# EAGLE design asynclabs_yellowjacket_v1 (EAGLE 5.06)
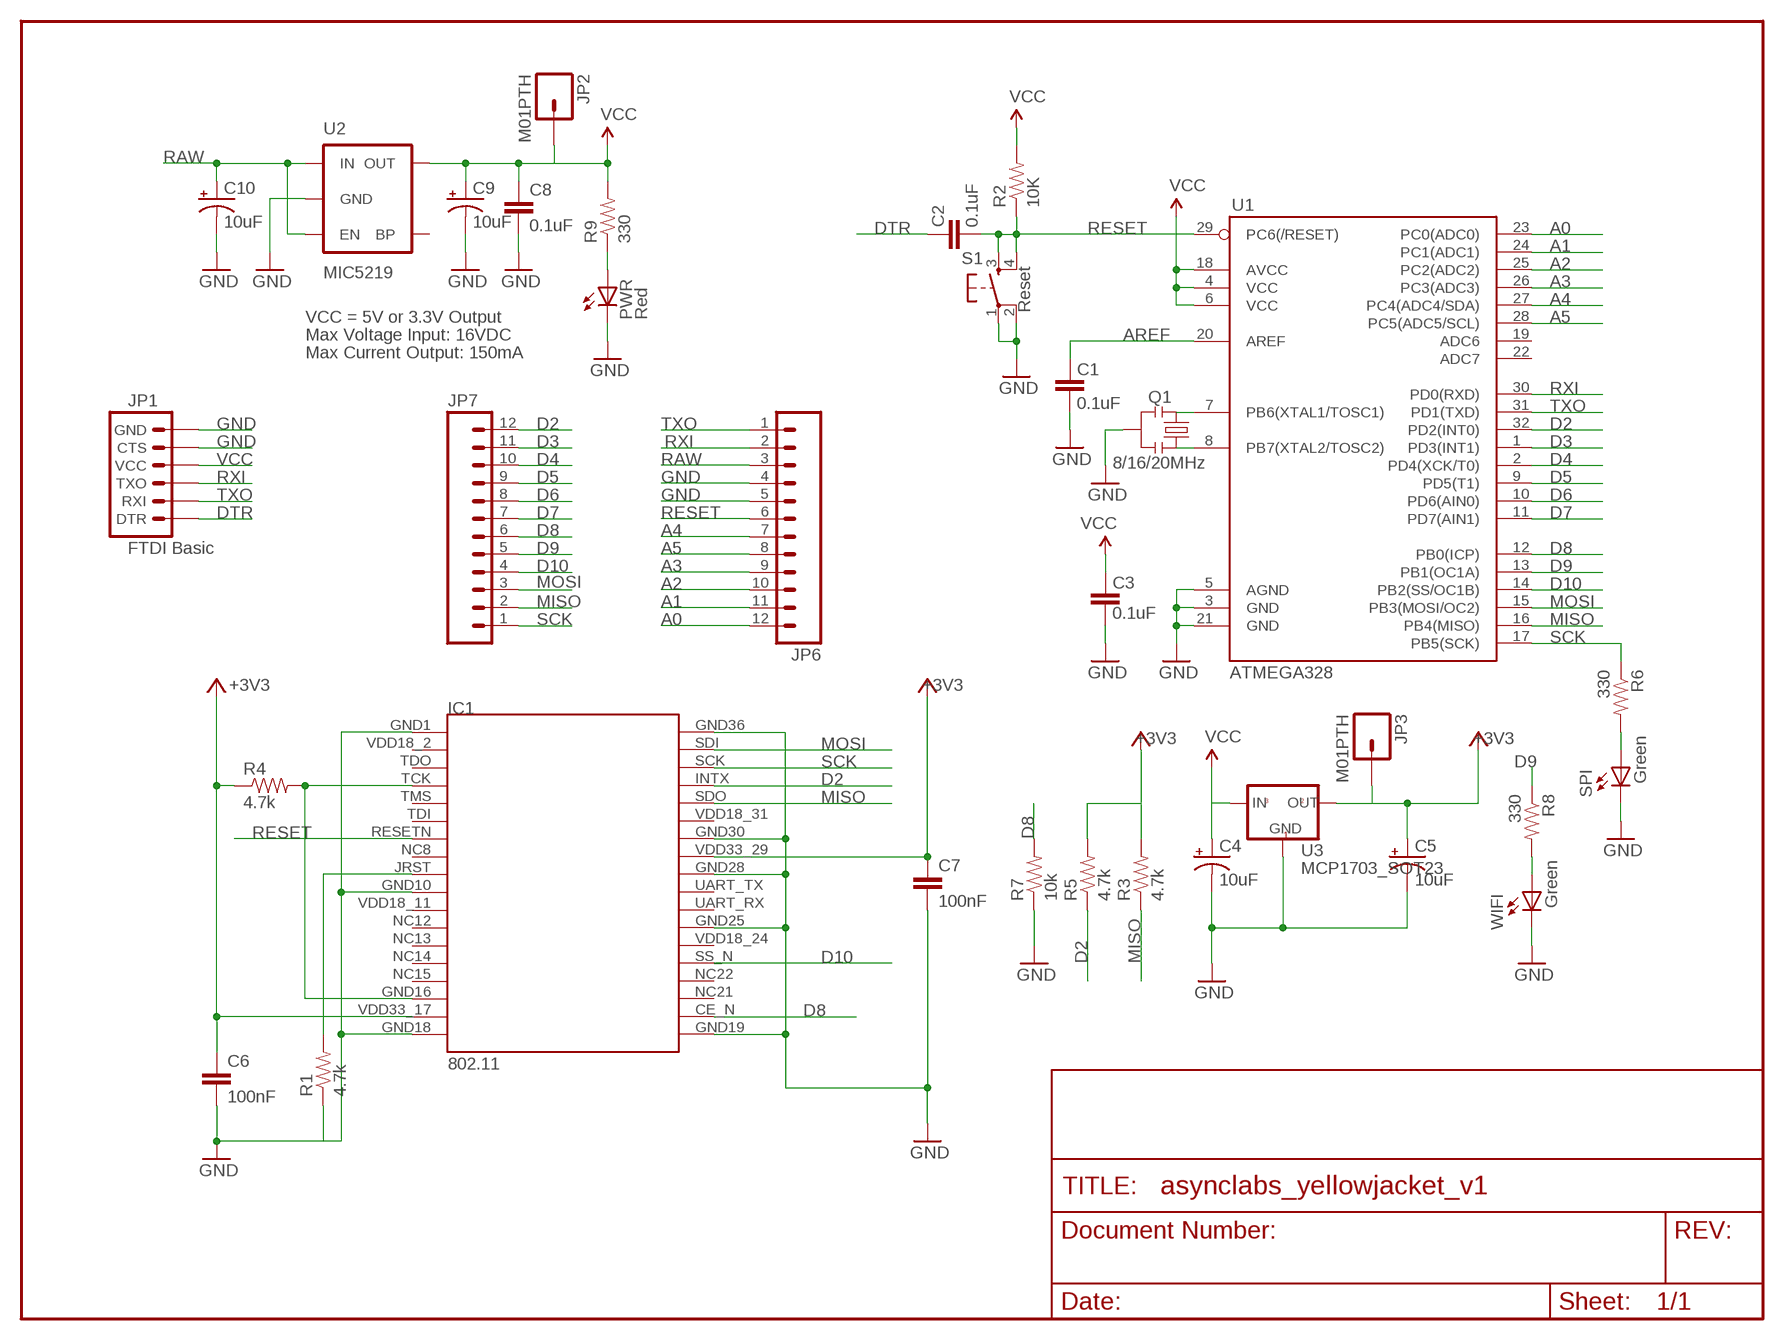
[diagram p0: schematic, sheet 1]

## Parts
C1  0.1uF  CAP0402  [C0402]
C2  0.1uF  CAP0402  [C0402]
C3  0.1uF  CAP0402  [C0402]
C4  10uF  CAP_POL1206  [EIA3216]
C5  10uF  CAP_POL1206  [EIA3216]
C6  100nF  CAPACITOR0402-CAP  [0402-CAP]
C7  100nF  CAPACITOR0402-CAP  [0402-CAP]
C8  0.1uF  CAP0402  [C0402]
C9  10uF  CAP_POL1206  [EIA3216]
C10  10uF  CAP_POL1206  [EIA3216]
IC1  802.11  ZG2100MOD  [ZG2100MOD]
JP1  FTDI Basic  ARDUINO_SERIAL_PROGRAMPTH  [1X06]
JP2  M01PTH  [1X01]
JP3  M01PTH  [1X01]
JP6  M12PTH  [1X12]
JP7  M12PTH  [1X12]
PWR  Red  LED0603  [LED-0603]
Q1  8/16/20MHz  RESONATORSMD  [RESONATOR-SMD]
R1  4.7k  RESISTOR0402-RES  [0402-RES]
R2  10K  RESISTOR0402  [C0402]
R3  4.7k  RESISTOR0402-RES  [0402-RES]
R4  4.7k  RESISTOR0402-RES  [0402-RES]
R5  4.7k  RESISTOR0402-RES  [0402-RES]
R6  330  RESISTOR0402  [C0402]
R7  10k  RESISTOR0402-RES  [0402-RES]
R8  330  RESISTOR0402  [C0402]
R9  330  RESISTOR0402  [C0402]
S1  Reset  TAC_SWITCHSND  [TACTILE_SWITCH_SMD]
SPI  Green  LED0603  [LED-0603]
U1  ATMEGA328  ATMEGA168  [TQFP32-08]
U2  MIC5219  V_REG_LDOSMD  [SOT23-5]
U3  MCP1703_SOT23  [SOT23-3]
WIFI  Green  LED0603  [LED-0603]

## Nets
+3V3: C5.A(+) C6.1 C7.1 IC1.VDD33_17 IC1.VDD33_29 JP3.1 R3.2 R4.1 R5.2 U3.2(OUT)
A0: JP6.12 U1.23(PC0(ADC0))
A1: JP6.11 U1.24(PC1(ADC1))
A2: JP6.10 U1.25(PC2(ADC2))
A3: JP6.9 U1.26(PC3(ADC3))
A4: JP6.7 U1.27(PC4(ADC4/SDA))
A5: JP6.8 U1.28(PC5(ADC5/SCL))
AREF: C1.2 U1.20(AREF)
D2: IC1.INTX JP7.12 R5.1 U1.32(PD2(INT0))
D3: JP7.11 U1.1(PD3(INT1))
D4: JP7.10 U1.2(PD4(XCK/T0))
D5: JP7.9 U1.9(PD5(T1))
D6: JP7.8 U1.10(PD6(AIN0))
D7: JP7.7 U1.11(PD7(AIN1))
D8: IC1.CE_N JP7.6 R7.2 U1.12(PB0(ICP))
D9: JP7.5 R8.1 U1.13(PB1(OC1A))
D10: IC1.SS_N JP7.4 U1.14(PB2(SS/OC1B))
DTR: C2.2 JP1.1(DTR)
GND [vcc]: C1.1 C3.1 C4.C(-) C5.C(-) C6.2 C7.2 C8.2 C9.C(-) C10.C(-) IC1.GND1 IC1.GND10 IC1.GND18 IC1.GND19 IC1.GND25 IC1.GND28 IC1.GND30 IC1.GND36 JP1.5(CTS) JP1.6(GND) JP6.4 JP6.5 PWR.C Q1.2 R1.1 R7.1 S1.1 S1.2 SPI.C U1.3(GND) U1.5(AGND) U1.21(GND) U2.2(GND) U3.1(GND) WIFI.C
JRST: IC1.JRST R1.2
MISO: IC1.SDO JP7.2 R3.1 U1.16(PB4(MISO))
MOSI: IC1.SDI JP7.3 U1.15(PB3(MOSI/OC2))
N$1: Q1.1 U1.8(PB7(XTAL2/TOSC2))
N$2: Q1.3 U1.7(PB6(XTAL1/TOSC1))
N$3: R8.2 WIFI.A
N$7: R6.2 SPI.A
N$38: PWR.A R9.1
RAW [vcc]: C10.A(+) JP6.3 U2.1(IN) U2.3(EN)
RESET: C2.1 IC1.RESETN(RSTN) JP6.6 R2.1 S1.3 S1.4 U1.29(PC6(/RESET))
RXI: JP1.3(TXO) JP6.2 U1.30(PD0(RXD))
SCK: IC1.SCK JP7.1 R6.1 U1.17(PB5(SCK))
TXO: JP1.2(RXI) JP6.1 U1.31(PD1(TXD))
VCC: C3.2 C4.A(+) C8.1 C9.A(+) JP1.4(VCC) JP2.1 R2.2 R9.2 U1.4(VCC) U1.6(VCC) U1.18(AVCC) U2.5(OUT) U3.3(IN)
VDD_TIE: IC1.GND16 IC1.TCK R4.2
Unconnected: IC1.NC8 IC1.NC12 IC1.NC13 IC1.NC14 IC1.NC15 IC1.NC21 IC1.NC22 IC1.TDI IC1.TDO IC1.TMS IC1.UART_RX IC1.UART_TX IC1.VDD18_2 IC1.VDD18_11 IC1.VDD18_24 IC1.VDD18_31 U1.19(ADC6) U1.22(ADC7) U2.4(BP)

## Notes on the sheet
- VCC = 5V or 3.3V Output
- Max Voltage Input: 16VDC
- Max Current Output: 150mA

## Library data of the parts
C1-C3 C8 = SparkFun:CAP: Capacitor Standard 0603 ceramic capacitor, and 0.1" leaded capacitor.
C4 C5 = asynlabs:CAP_POL: Capacitor Polarized These are standard SMD and PTH capacitors. Normally 10uF, 47uF, and 100uF in electrolytic and tantalum varieties. Always verify the external diameter of the through hole cap, it varies with capacity, voltage, and manufacturer. The EIA devices should be standard.
C6 C7 = asynlabs:CAPACITOR: Capacitor Standard 0603 ceramic capacitor, and 0.1" leaded capacitor.
C9 C10 = SparkFun:CAP_POL: Capacitor Polarized These are standard SMD and PTH capacitors. Normally 10uF, 47uF, and 100uF in electrolytic and tantalum varieties. Always verify the external diameter of the through hole cap, it varies with capacity, voltage, and manufacturer. The EIA devices should be standard.
IC1 = ZGLIB:ZG2100MOD: ZG2100 Module
JP1 = SparkFun:ARDUINO_SERIAL_PROGRAM
JP2 JP3 = SparkFun:M01: Header 1 Standard 1-pin 0.1" header. Use with straight break away headers (SKU : PRT-00116), right angle break away headers (PRT-00553), swiss pins (PRT-00743), machine pins (PRT-00117), and female headers (PRT-00115).
JP6 JP7 = SparkFun:M12: Header 12 Standard 12-pin 0.1" header. Use with straight break away headers (SKU : PRT-00116), right angle break away headers (PRT-00553), swiss pins (PRT-00743), machine pins (PRT-00117), and female headers (PRT-00115).
PWR SPI WIFI = SparkFun:LED: LEDs Standard schematic elements and footprints for 5mm, 3mm, 1206, and 0603 sized LEDs. 5mm - Spark Fun Electronics SKU : COM-00529 (and others)
Q1 = SparkFun:RESONATOR: Resonator Small SMD resonator. This is the itty bitty 10/20MHz resonators with built in caps. CSTCE10M0G55 and CSTCE20M0V53. Footprint has been reviewed closely but hasn't been tested yet.
R1 R3-R5 R7 = asynlabs:RESISTOR: Resistor Basic schematic elements and footprints for 0603, 1206, and PTH 1/10th watt (small) resistors.
R2 R6 R8 R9 = SparkFun:RESISTOR: Resistor Basic schematic elements and footprints for 0603, 1206, and PTH 1/10th watt (small) resistors.
S1 = SparkFun:TAC_SWITCH: Momentary Switch Button commonly used for reset or general input. Spark Fun Electronics SKU : COM-00097
U1 = SparkFun:ATMEGA168
U2 = SparkFun:V_REG_LDO: Voltage Regulator LDO Standard 150mA LDO voltage regulator in SOT-23 layout. Micrel part MIC5205. BP (by-pass) pin is used to lower output noise with 470pF cap.
U3 = asynlabs:MCP1703_SOT23: Voltage Regulator

## Net classes
0 default: width 0.203 mm
1 vcc: width 0.254 mm

## Board
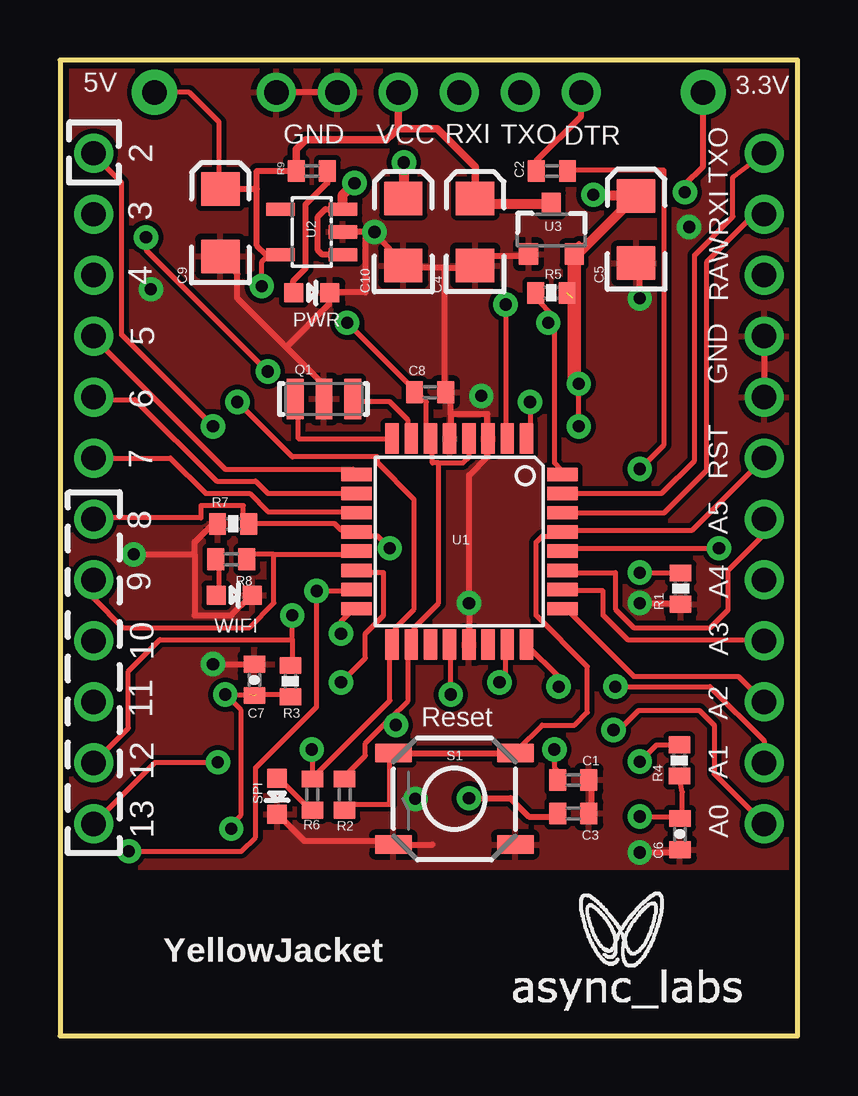
[diagram p1: board, top side]
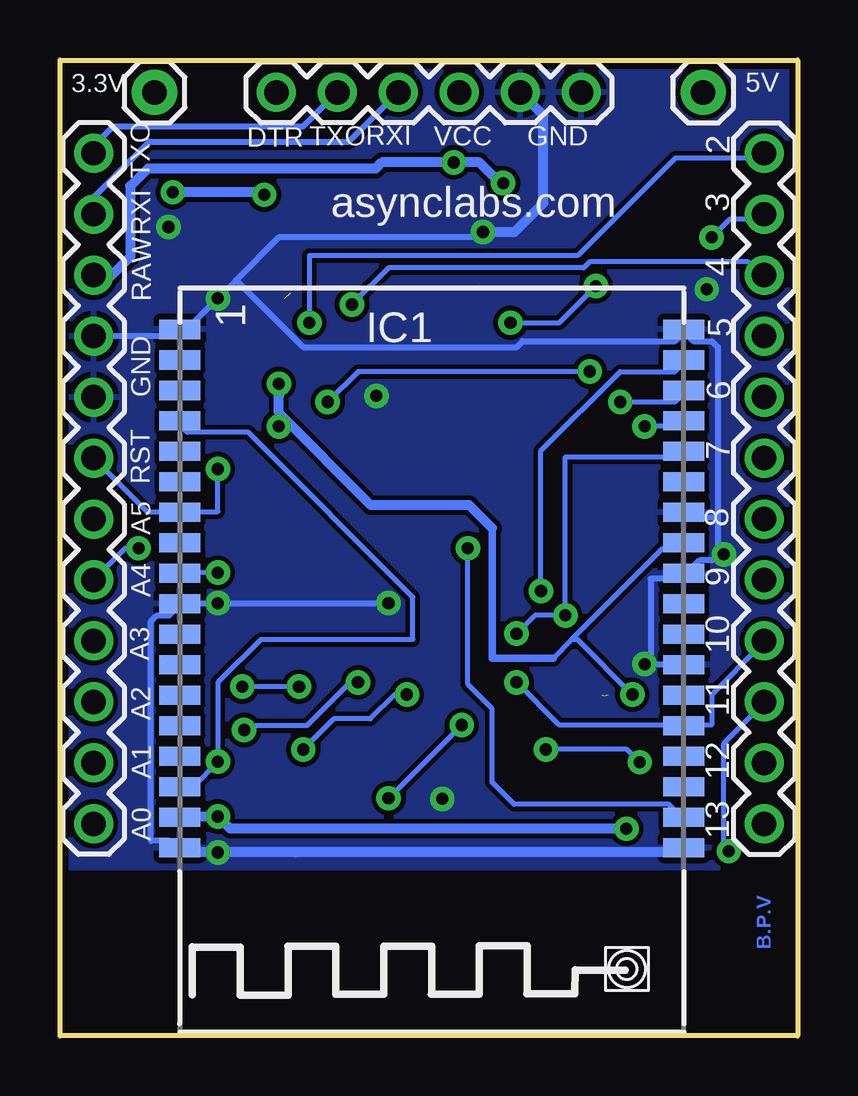
[diagram p2: board, bottom side, seen from below]

Size 30.73 x 40.67 mm. Coordinates in mm from the lower left corner, seen from the top.
Outline: 0,40.66 0,0 30.73,0 30.73,40.66 0,40.66
Copper layers (1*16): Top 0.035mm / dielectric 1.5mm / Bottom 0.035mm
Design rules "SparkFun *": minimum track width 8mil, minimum drill 20mil, track to track 8mil, track to pad 8mil, pad to pad 8mil, via to via 8mil, smd to smd 8mil, copper to edge 10mil, drill to drill 8mil, minimum pad ring 12mil, minimum via ring 10mil, stop-mask expansion 4mil, vias tented up to drill 20mil, thermal gap 10mil

### Footprints (pad centres in the part's own frame; a part is rotated, then mirrored left to right if it is on the bottom)
C0402 = smd 0.7 x 0.9: 1 -0.65,0; 2 0.65,0
EIA3216 = smd 1.4 x 1.6: A 1.4,0; C -1.4,0
0402-CAP = smd 0.7 x 0.9: 1 -0.65,0; 2 0.65,0
ZG2100MOD = smd 0.8 x 1.7: CE_N 6.63,10.12; GND1 -13.69,-10.88; GND10 -2.26,-10.88; GND16 5.36,-10.88; GND18 7.9,-10.88; GND19 7.9,10.12; GND25 0.28,10.12; GND28 -3.53,10.12; GND30 -6.07,10.12; GND36 -13.69,10.12; INTX -9.88,10.12; JRST -3.53,-10.88; NC8 -4.8,-10.88; NC12 0.28,-10.88; NC13 1.55,-10.88; NC14 2.82,-10.88; NC15 4.09,-10.88; NC21 5.36,10.12; NC22 4.09,10.12; RESETN -6.07,-10.88; SCK -11.15,10.12; SDI -12.42,10.12; SDO -8.61,10.12; SS_N 2.82,10.12; TCK -9.88,-10.88; TDI -7.34,-10.88; TDO -11.15,-10.88; TMS -8.61,-10.88; UART_RX -0.99,10.12; UART_TX -2.26,10.12; VDD18_2 -12.42,-10.88; VDD18_11 -0.99,-10.88; VDD18_24 1.55,10.12; VDD18_31 -7.34,10.12; VDD33_17 6.63,-10.88; VDD33_29 -4.8,10.12
1X06 = drill 1.016 round: 1 0,0; 2 2.54,0; 3 5.08,0; 4 7.62,0; 5 10.16,0; 6 12.7,0
1X01 = drill 1.016 pad 1.88 round: 1 0,0
1X12 = drill 1.016 round: 1 0,0; 2 2.54,0; 3 5.08,0; 4 7.62,0; 5 10.16,0; 6 12.7,0; 7 15.24,0; 8 17.78,0; 9 20.32,0; 10 22.86,0; 11 25.4,0; 12 27.94,0
LED-0603 = smd 0.8 x 0.8: A 0,-0.75; C 0,0.75
RESONATOR-SMD = smd 0.7 x 1.7: 1 -1.2,0; 2 0,0; 3 1.2,0
0402-RES = smd 0.7 x 0.9: 1 -0.65,0; 2 0.65,0
TACTILE_SWITCH_SMD = smd 1.524 x 0.762: 1 -2.54,1.905; 2 2.54,1.905; 3 -2.54,-1.905; 4 2.54,-1.905
TQFP32-08 = smd 1.27 x 0.559: 1 -4.293,2.8; 2 -4.293,2; 3 -4.293,1.2; 4 -4.293,0.4; 5 -4.293,-0.4; 6 -4.293,-1.2; 7 -4.293,-2; 8 -4.293,-2.8; 17 4.293,-2.8; 18 4.293,-2; 19 4.293,-1.2; 20 4.293,-0.4; 21 4.293,0.4; 22 4.293,1.2; 23 4.293,2; 24 4.293,2.8 | smd 0.559 x 1.27: 9 -2.8,-4.293; 10 -2,-4.293; 11 -1.2,-4.293; 12 -0.4,-4.293; 13 0.4,-4.293; 14 1.2,-4.293; 15 2,-4.293; 16 2.8,-4.293; 25 2.8,4.293; 26 2,4.293; 27 1.2,4.293; 28 0.4,4.293; 29 -0.4,4.293; 30 -1.2,4.293; 31 -2,4.293; 32 -2.8,4.293
SOT23-5 = smd 0.55 x 1.2: 1 -0.95,-1.3; 2 0,-1.3; 3 0.95,-1.3; 4 0.95,1.3; 5 -0.95,1.3
SOT23-3 = smd 0.8 x 0.9: 1 -0.95,-1; 2 0.95,-1; 3 0,1.1

### Placement (x,y rotation side)
C1  21.39,10.67 180 top
C2  20.5,36.04 180 top
C3  21.39,9.27 180 top
C4  17.3,33.5 90 top
C5  24,33.6 90 top
C6  25.83,8.41 270 top
C7  8.1,14.83 90 top
C8  15.42,26.82 0 top
C9  6.68,33.88 90 top
C10  14.3,33.5 90 top
IC1  14.86,15.75 270 bottom
JP1  21.72,39.32 0 bottom
JP2  3.94,39.32 0 bottom
JP3  26.8,39.32 0 bottom
JP6  29.34,36.78 270 bottom
JP7  1.4,8.84 90 bottom
PWR  10.49,30.96 270 top
Q1  11,26.54 0 top
R1  25.86,18.64 90 top
R2  11.86,10.06 90 top
R3  9.6,14.78 270 top
R4  25.81,11.48 90 top
R5  20.47,30.96 0 top
R6  10.52,10.06 270 top
R7  7.21,21.34 0 top
R8  7.14,19.86 180 top
R9  10.49,36.04 180 top
S1  16.43,9.88 180 top
SPI  9.04,9.98 180 top
U1  16.64,20.6 270 top
U2  10.49,33.5 90 top
U3  20.47,33.58 0 top
WIFI  7.26,18.36 270 top

### Tracks (layer width: path | path; a pad name or v marks a point on that pad's centre or on a via)
+3V3  (via drill 0.51)  (3 unrouted)
  Top 0.203: R4.1 25.93,10.16 25.93,9.14 C6.1 25.68,9.14 v24.16,9.14 | v21.62,27.18 21.36,27.43 | 7.9,14.22 v6.88,14.22 7.54,13.56 7.54,9.22 7.14,8.81 v7.14,8.64 | 8.15,14.22 9.42,14.22 R3.2 | v21.62,25.4 21.62,33.02 U3.2
  Top 0.254: 26.04,35.46 26.8,36.22 JP3.1
  Top 0.406: U3.2 21.58,32.58 C5.A 22.23,35 v22.23,35.05 | v26.04,35.15 26.04,35.46 | 21.36,27.43 21.36,30.43 | 21.36,30.43 21.36,30.73 | 21.36,30.43 21.36,32.51
  Bottom 0.203: 25.68,9.14 IC1.VDD33_17 | 9.42,16.51 5.61,20.32 5.11,20.32 | 9.42,16.51 10.19,15.75 | 5.11,20.32 4.85,20.32 | v6.88,14.22 9.17,16.51 9.42,16.51 | 5.11,20.32 IC1.VDD33_29 | 21.62,26.67 v21.62,25.4
  Bottom 0.305: 12.73,21.16 12.73,15.75 10.19,15.75
  Bottom 0.406: v26.04,35.15 22.23,35.15 v22.23,35.05 | 25.68,9.14 v24.16,9.14 23.65,8.64 v7.14,8.64 | v21.62,27.18 21.62,26.67 21.62,25.96 17.78,22.12 13.69,22.12 12.73,21.16
A0  (via drill 0.51)
  Top 0.203: v18.31,14.73 18.57,14.99 18.57,16.26 U1.23 | 23.14,12.95 v23.06,12.75 23.29,12.75 24.1,13.56 26.64,13.56 27.25,12.95 27.25,10.92 JP6.12
  Bottom 0.203: v18.31,14.73 18.64,14.73 20.45,12.93 22.89,12.93 v23.06,12.75
A1  (via drill 0.51)
  Top 0.203: 19.33,16.26 U1.24 20.78,14.97 v20.78,14.55 | JP6.11 29.34,12.29 27.08,14.55 v23.14,14.55
  Bottom 0.203: v20.78,14.55 v23.14,14.55
A2
  Top 0.203: U1.25 21.11,17.78 23.9,14.99 28.27,14.99 JP6.10
A3
  Top 0.203: U1.26 21.11,18.54 22.63,18.54 22.63,17.53 23.65,16.51 29.29,16.51 JP6.9
A4
  Top 0.203: U1.27 21.11,19.3 23.14,19.3 23.14,17.78 23.9,17.02 27.1,17.02 27.84,17.75 27.84,19.41 29.34,20.9 JP6.7
A5  (via drill 0.51)
  Top 0.203: v27.46,20.32 21.11,20.32 U1.28
  Bottom 0.203: v27.46,20.32 28.02,20.32 JP6.8
AREF  (via drill 0.51)
  Top 0.203: v20.6,11.94 20.6,11.18 20.85,10.92 C1.2 | v16.28,14.22 16.28,16.26 U1.20
  Top 0.254: C1.2 20.88,10.67 20.88,10.99
  Bottom 0.203: v20.6,11.94 19.33,13.21 17.81,13.21 16.79,14.22 v16.28,14.22
D2  (via drill 0.51)
  Top 0.203: 20.6,29.72 20.6,23.88 20.85,23.62 U1.32 | 20.6,29.72 20.6,29.97 19.84,30.73 R5.1 | v6.38,25.4 2.57,29.21 2.57,35.56 1.55,36.58 JP7.12 | v20.35,29.72 20.6,29.72
  Bottom 0.203: v6.38,25.4 4.85,25.4 IC1.INTX | v20.35,29.72 20.35,32.51 9.17,32.51 5.11,36.58 1.55,36.58 JP7.12
D3  (via drill 0.51)
  Top 0.203: v19.58,26.42 19.58,24.89 U1.1 | v8.66,27.69 3.58,32.77 v3.58,33.27
  Bottom 0.203: v19.58,26.42 18.31,27.69 v8.66,27.69 | v3.58,33.27 2.82,34.04 1.55,34.04 JP7.11
D4  (via drill 0.51)
  Top 0.203: v18.57,30.48 18.57,24.89 U1.2
  Bottom 0.203: v18.57,30.48 17.04,32 8.92,32 8.66,32.26 2.06,32.26 1.55,31.75 JP7.10
D5
  Top 0.203: U1.9 12.22,23.62 6.88,23.62 1.55,28.96 JP7.9
D6
  Top 0.203: U1.10 12.22,22.61 8.66,22.61 8.15,23.11 6.53,23.11 3.12,26.52 1.5,26.52 JP7.8
D7
  Top 0.203: U1.11 12.22,21.84 8.66,21.84 7.9,22.61 6.07,22.61 4.6,24.08 JP7.7
D8  (via drill 0.51)
  Top 0.203: v13.74,20.32 13.23,20.83 12.47,20.83 U1.12 12.22,21.08 11.71,21.08 11.46,21.34 R7.2 7.65,21.34 7.65,22.1 5.87,22.1 5.87,21.59 1.55,21.59 JP7.6
  Bottom 0.203: IC1.CE_N 4.85,9.14 5.36,9.65 11.81,9.65 12.73,10.57 12.73,13.64 13.74,14.66 v13.74,20.32
D9
  Top 0.203: 8.92,20.07 12.22,20.07 U1.13 | 8.92,20.07 7.9,20.07 R8.1 | 8.92,20.07 8.92,18.03 7.9,17.02 2.62,17.02 1.4,18.24 JP7.5
D10  (via drill 0.51)
  Top 0.203: v11.71,14.73 12.73,15.75 12.73,16.76 13.49,17.53 13.49,19.3 12.47,19.3 U1.14
  Bottom 0.203: v11.71,14.73 9.93,12.95 4.85,12.95 IC1.SS_N 4.6,12.95 3.58,12.95 3.58,14.22 1.55,16.26 JP7.4
DTR
  Top 0.254: 19.89,36.08 19.69,36.3 | JP1.1 21.72,38.33 19.85,36.46 C2.2
  Top 0.406: C2.2 19.89,36.08
GND  (via drill 0.51)
  Top 0.254: 22.15,10.85 22.15,10.67 C1.1 22.15,10.65 22.15,9.27 C3.1 21.87,9.14 | v13.11,33.5 U2.2 | SPI.C 9.17,9.14 10.19,8.13 13.74,8.13 S1.2 | S1.2 14,7.87 | v24.16,18.03 25.68,18.03 R1.1 | v24.16,7.64 25.68,7.64 C6.2 | v6.38,15.49 7.9,15.49 C7.2 | 5.61,20.07 5.61,20.57 6.38,21.34 R7.1 | 5.61,20.07 5.61,17.53 7.14,17.53 7.9,18.29 WIFI.C | v3.07,20.07 5.61,20.07 | v24.16,30.73 24.16,32 C5.C | JP6.5 JP6.4 29.34,29.18 | 16.28,25.91 16.28,24.89 U1.5 | 16.28,25.91 16.28,26.67 C8.2 16.03,26.92 16.03,32 | 17.81,24.89 17.81,24.13 17.04,23.37 v17.04,18.03 17.04,16.51 U1.21 | 16.28,25.91 17.81,25.91 17.81,24.89 | 17.81,24.89 U1.3 | 9.42,28.7 10.95,27.18 10.95,26.67 Q1.2 | 9.42,28.7 7.39,30.73 7.39,31.75 6.88,32.26 C9.C | U3.1 19.33,32.51 17.3,32.51 C4.C 17.3,32 16.03,32 | v13.11,33.5 12.73,33.53 12.73,30.99 11.46,30.99 PWR.C 11.2,30.73 11.2,30.48 9.42,28.7 | v13.11,33.5 13.23,33.27 14.25,32.26 C10.C 14.5,32 16.03,32 | JP1.5 JP1.6 | S1.2 15.52,7.98
  Bottom 0.254: 25.68,7.64 IC1.GND18 25.93,7.87 26.19,8.13 26.95,8.13 26.95,17.27 26.7,17.53 26.19,17.53 25.93,17.78 IC1.GND10 25.68,18.03 v24.16,18.03 v17.04,18.03 | 20.93,7.64 20.35,7.62 | IC1.GND19 5.28,7.64 | 6.12,15.49 4.85,15.49 IC1.GND25 | 3.33,20.07 3.58,19.81 4.09,19.81 4.6,19.3 IC1.GND28 4.85,19.05 6.12,19.05 6.12,15.49 | 3.33,21.59 3.33,20.07 | 3.33,21.59 4.6,21.59 IC1.GND30 | 3.33,21.59 3.33,28.7 3.58,28.96 4.34,28.96 4.6,29.21 IC1.GND36 4.85,29.21 5.11,28.96 11.46,28.96 11.71,28.7 20.6,28.7 23.39,31.5 | 3.33,20.07 v3.07,20.07 | 6.12,15.49 v6.38,15.49 | JP6.4 26.04,29.16 IC1.GND1 25.68,29.46 25.43,29.46 v24.16,30.73 23.39,31.5 | 23.39,31.5 21.62,33.27 13.23,33.27 v13.11,33.5
  Bottom 0.406: v13.11,33.5 U2.2 10.59,34.7 10.59,38.35 JP1.5 | 25.68,7.64 v24.16,7.64 20.93,7.64 5.28,7.64
  other vias: 14.81,9.88 17.55,26.67 3.78,31.11 26.21,33.71
  pour Bottom: 0.1,40.67 30.86,40.67 30.76,7.04 -0.08,7.04 0.03,40.64
  pour Top: 0.03,40.64 30.78,40.64 30.76,7.04 -0.08,7.04 -0.05,40.61
JRST  (via drill 0.51)
  Top 0.203: v24.16,19.3 25.68,19.3 R1.2
  Bottom 0.203: v24.16,19.3 25.68,19.3 IC1.JRST
MISO  (via drill 0.51)
  Top 0.203: 9.68,16.51 v9.68,17.53 | 9.68,16.51 9.68,15.49 R3.1 | v11.71,16.76 11.71,17.27 12.22,17.78 U1.16 | 9.68,16.51 4.17,16.51 2.84,15.19 2.84,12.83 JP7.2
  Bottom 0.203: IC1.SDO 4.85,24.13 9.68,24.13 v9.68,17.53 10.95,17.53 v11.71,16.76
MOSI  (via drill 0.51)
  Top 0.203: U1.15 12.22,18.54 v10.69,18.54 10.69,13.72 8.15,11.18 8.15,8.28 7.54,7.7 v2.87,7.7
  Bottom 0.203: JP7.3 1.55,13.72 3.07,12.19 3.07,7.9 v2.87,7.7 | v10.69,18.54 10.69,24.38 7.39,27.69 5.11,27.69 4.85,27.94 IC1.SDI
N$1
  Top 0.203: U1.8 9.93,24.89 9.93,26.42 Q1.1
N$2
  Top 0.203: U1.7 14.5,24.89 14.5,25.65 13.74,26.42 12.22,26.42 Q1.3
N$3
  Top 0.203: WIFI.A 6.63,18.54 6.63,19.81 R8.2
N$7
  Top 0.203: SPI.A 9.17,10.67 10.44,9.4 R6.2
N$38
  Top 0.254: R9.1 11.14,35.55 10.24,34.65 10.24,31.98 9.73,31.47 PWR.A
RAW  (via drill 0.51)
  Top 0.254: U2.3 11.06,34.45 10.74,34.14 10.74,32.74 10.93,32.55 U2.1
  Top 0.406: U2.3 11.79,35.06 v12.27,35.53 | C10.A 14.33,34.9 v14.33,36.4
  Bottom 0.406: v12.27,35.53 12.4,35.53 13.26,36.4 v14.33,36.4 17.32,36.4 17.58,36.14 27.08,36.14 27.81,35.41 27.81,32.46 28.58,31.7 JP6.3
RESET  (via drill 0.51)
  Top 0.203: v24.16,23.62 25.17,24.64 25.17,36.07 21.36,36.07 C2.1 | R2.1 11.96,9.65 13.74,9.65 13.74,11.68 S1.4 | S1.3 19.08,11.94 20.09,12.95 21.44,12.95 21.97,13.49 21.97,15.39 19.84,17.53 19.84,20.57 20.09,20.83 20.85,20.83 U1.29 21.11,21.08 26.34,21.08 JP6.6
  Top 0.254: R2.1 11.88,9.42 | S1.4 S1.3
  Bottom 0.203: v24.16,23.62 24.16,21.84 25.68,21.84 IC1.RESETN 25.93,21.84 27.1,21.84 JP6.6
RXI
  Top 0.203: 21.11,21.84 U1.30 25.17,21.79 26.95,23.57 26.95,32.26 28.93,34.24 JP6.2
  Bottom 0.254: JP1.3 18.69,37.26 27.03,37.26 29.34,34.95 JP6.2
SCK  (via drill 0.51)
  Top 0.203: v7.39,26.42 9.68,24.13 13.23,24.13 13.23,23.88 14.76,22.35 14.76,17.78 14,17.02 14,16.51 U1.17 13.74,16.26 13.74,13.97 10.69,10.92 R6.1 10.52,11.91 v10.49,11.94 | v6.58,11.4 3.96,11.4 JP7.1
  Bottom 0.203: v7.39,26.42 5.11,26.42 4.85,26.67 IC1.SCK | v10.49,11.94 7.11,11.94 v6.58,11.4
  Bottom 0.254: JP7.1 1.37,8.81
TXO
  Top 0.203: 21.11,22.61 U1.31 20.94,22.61 25.07,22.61 26.44,23.98 26.44,32.54 28.04,34.14 28.04,35.79 JP6.1
  Bottom 0.254: JP1.2 20.6,37.9 28.52,37.9 29.34,37.08 JP6.1
VCC  (via drill 0.51)
  Top 0.203: 15.77,23.88 15.52,23.88 15.52,24.89 U1.6 15.27,24.89 15.27,26.42 15.01,26.67 C8.1 14.76,26.92 v11.96,29.72 | 15.77,23.88 16.79,23.88 17.04,24.13 U1.4 | 13.74,13.21 14.5,13.97 14.5,16.26 U1.18 14.76,16.51 14.76,17.02 15.77,18.03 15.77,23.88 | 13.74,13.21 12.73,12.19 12.73,11.68 11.96,10.92 R2.2 | 13.74,13.21 v14,12.95 | 20.6,9.14 C3.2 | v8.41,31.24 8.41,32.26 8.66,32.51 U2.5 | C9.A 6.63,35.31 6.63,38.08 5.38,39.32 JP2.1
  Top 0.254: C9.A 8.2,35.28 | C3.2 20.88,9.27 | U2.5 8.59,32.55 8.2,32.93 8.2,35.28 | 8.2,35.28 8.2,36.04 R9.2 | 20.6,9.14 19.53,9.14 18.77,9.91 v17.04,9.91
  Top 0.305: R9.2 9.84,36.94 10.24,37.34 13.59,37.34 14.1,37.8 | 14.1,37.8 JP1.4 | 14.1,37.8 15.72,37.8 17.3,36.22 C4.A
  Top 0.406: U3.3 17.52,34.68 C4.A
  Bottom 0.203: v14,12.95 v17.04,9.91 | v8.41,31.24 9.93,29.72 v11.96,29.72
VDD_TIE  (via drill 0.51)
  Top 0.203: v24.16,11.43 24.86,12.13 R4.2
  Bottom 0.203: IC1.GND16 25.68,10.41 25.17,10.41 v24.16,11.43 24.16,14.73 22.38,16.51 16.03,16.51 16.03,18.29 22.89,25.15 25.43,25.15 25.68,25.4 IC1.TCK

### Text on the board
Bottom: B.P.V
tPlace: 5V | 3.3V | GND | VCC | RXI | TXO | DTR | 2 | TXO | 3 | RXI | 4 | RAW | 5 | GND | 6 | 7 | RST | 8 | A5 | 9 | A4 | 10 | A3 | 11 | Reset | A2 | 12 | A1 | 13 | A0
bPlace: 5V | 3.3V | 2 | GND | VCC | RXI | TXO | DTR | TXO | asynclabs.com | 3 | RXI | 4 | RAW | 5 | 6 | GND | 7 | RST | 8 | A5 | 9 | 10 | A4 | A3 | 11 | A2 | 12 | A1 | 13 | A0
tNames: YellowJacket